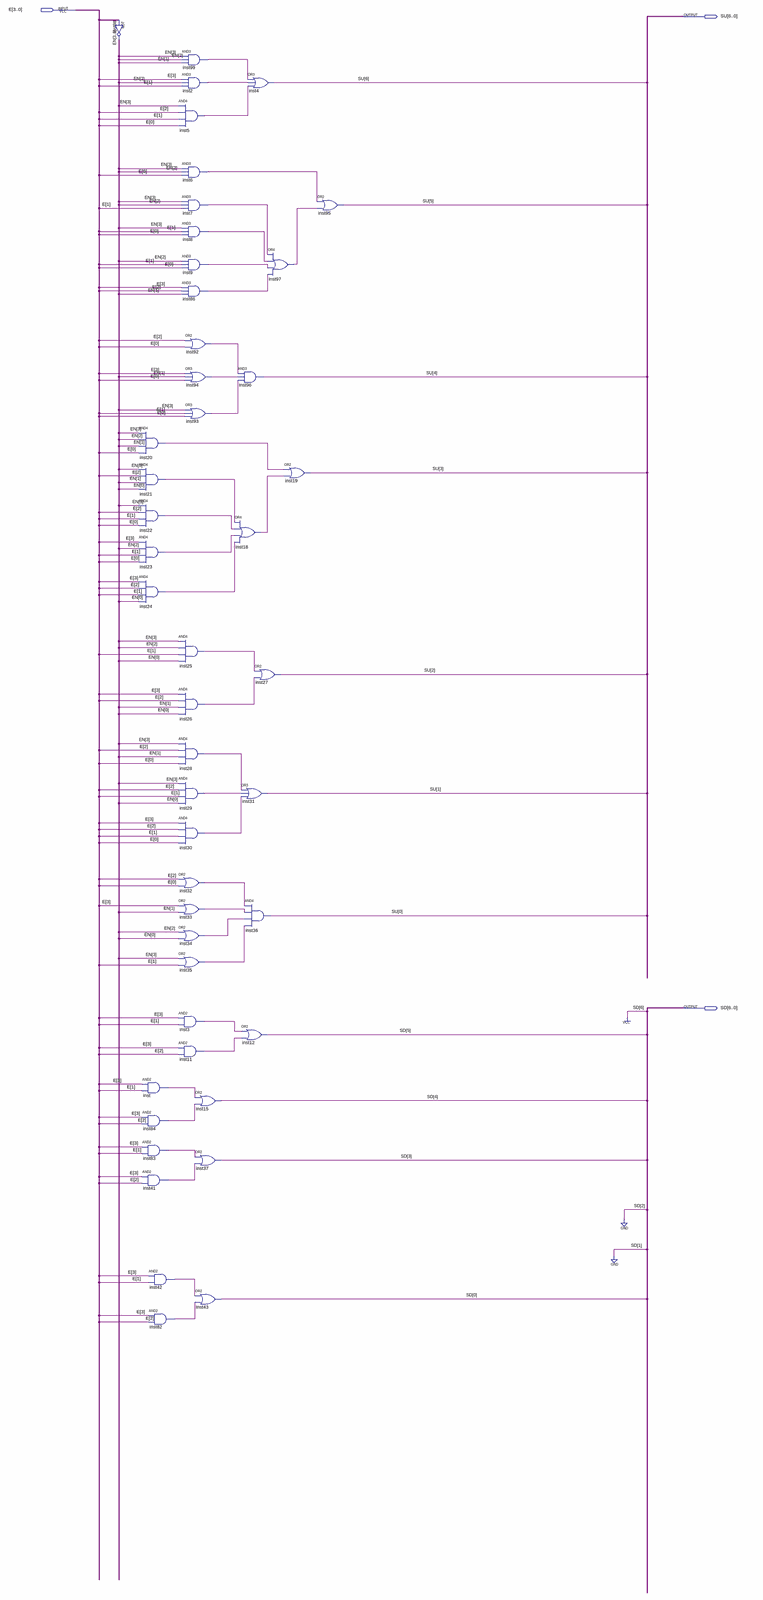
[diagram p0: schematic sheet, whole]
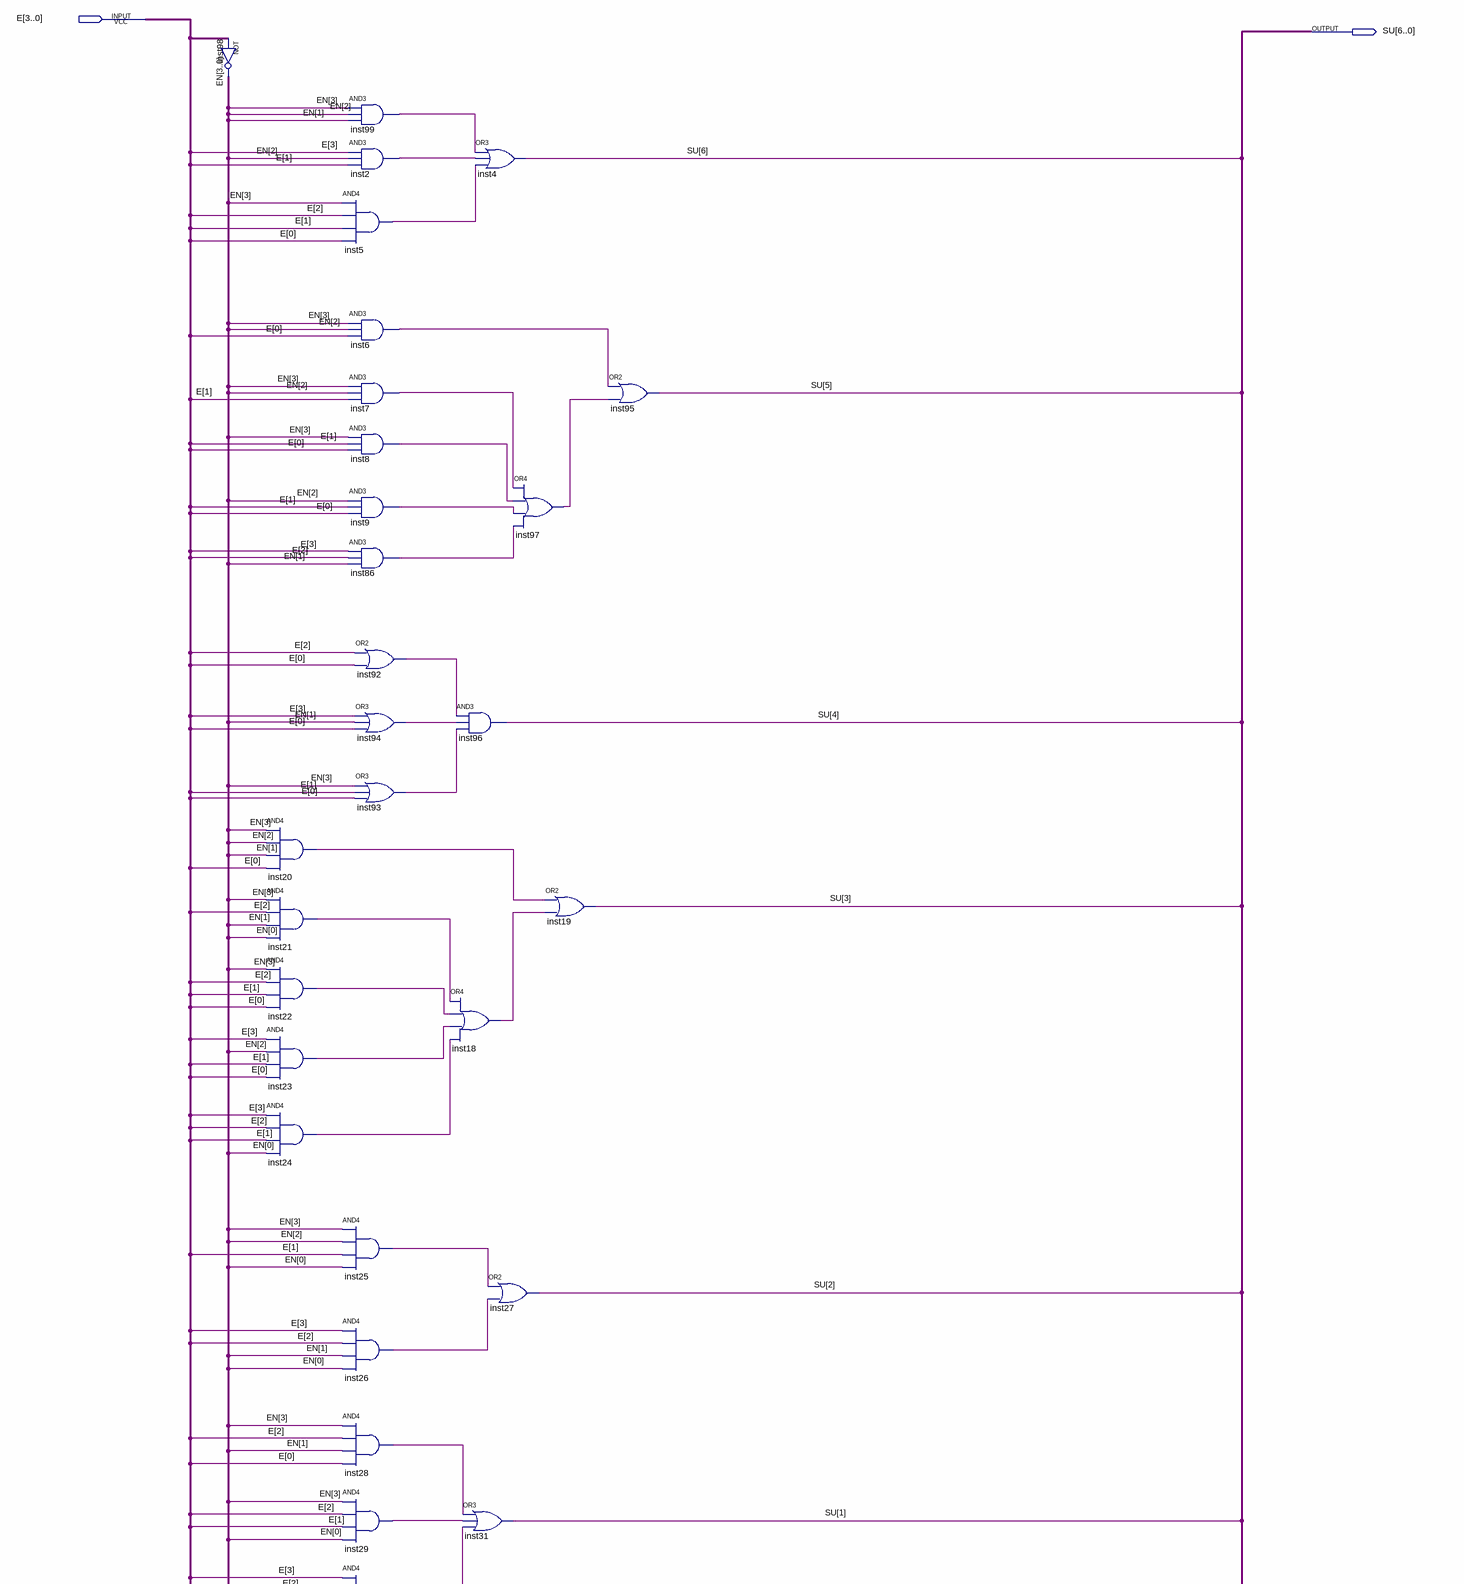
[diagram p1: schematic sheet, upper part]
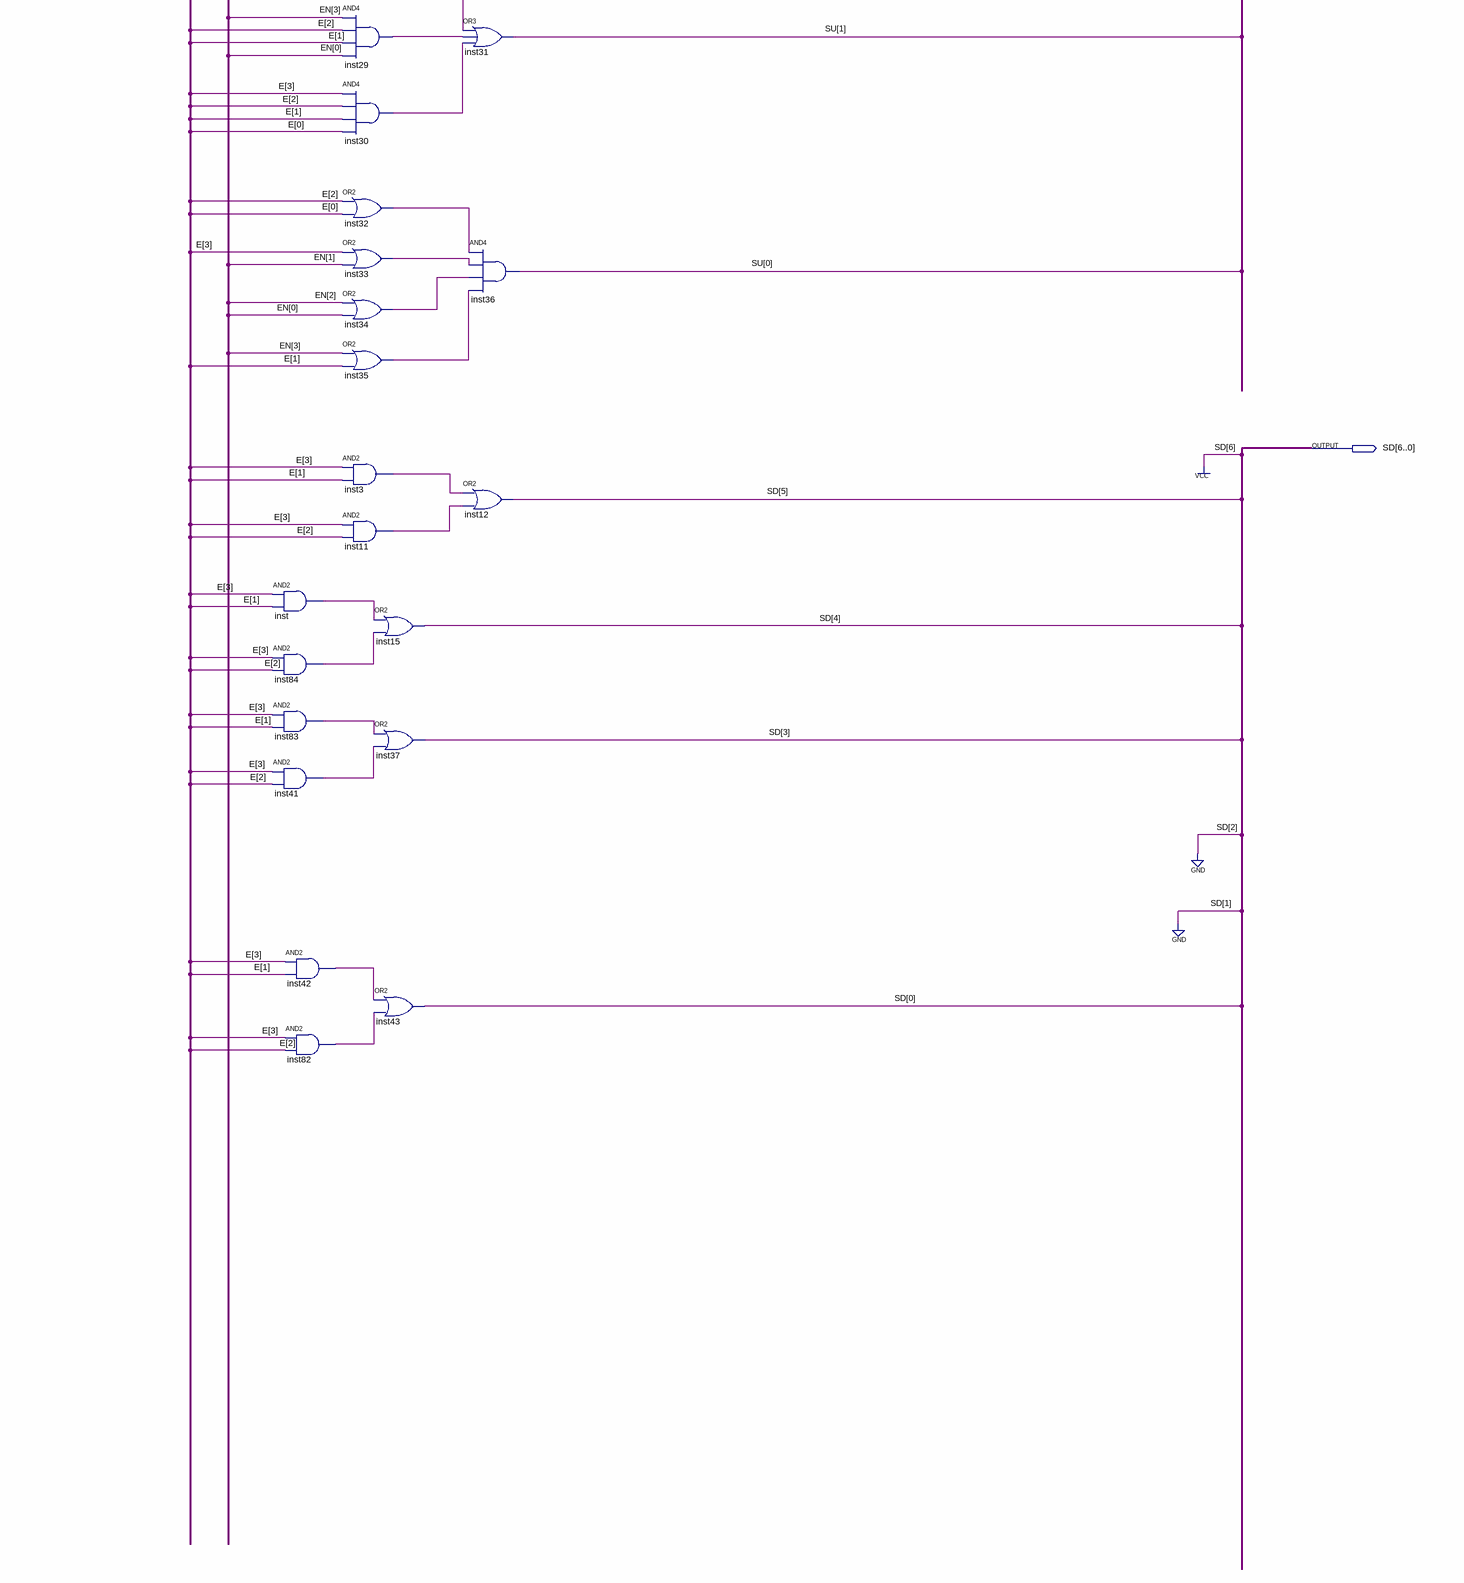
[diagram p2: schematic sheet, lower part]
// Quartus schematic decodificador4bits.bdf as structural Verilog: 47 symbols, 3 pins
module decodificador4bits (
  input  [3:0] E,
  output [6:0] SU,
  output [6:0] SD
);

  wire inst2_out, inst3_out, inst5_out, inst6_out, inst7_out, inst8_out, inst9_out, inst11_out, inst18_out,
       inst20_out, inst21_out, inst22_out, inst23_out, inst24_out, inst25_out, inst26_out, inst28_out,
       inst29_out, inst30_out, inst32_out, inst33_out, inst34_out, inst35_out, inst41_out, inst42_out,
       inst82_out, inst83_out, inst84_out, inst86_out, inst92_out, inst93_out, inst94_out, inst97_out,
       inst99_out, inst_out;
  wire [3:0] EN;

  assign EN = ~E;  // NOT inst98, 4 bits wide
  and inst20 (inst20_out, EN[3], EN[2], EN[1], E[0]);
  and inst21 (inst21_out, EN[3], E[2], EN[1], EN[0]);
  and inst22 (inst22_out, EN[3], E[2], E[1], E[0]);
  and inst23 (inst23_out, E[3], EN[2], E[1], E[0]);
  and inst24 (inst24_out, E[3], E[2], E[1], EN[0]);
  and inst (inst_out, E[3], E[1]);
  and inst84 (inst84_out, E[3], E[2]);
  and inst83 (inst83_out, E[3], E[1]);
  and inst41 (inst41_out, E[3], E[2]);
  and inst42 (inst42_out, E[3], E[1]);
  and inst82 (inst82_out, E[3], E[2]);
  and inst99 (inst99_out, EN[3], EN[2], EN[1]);
  and inst2 (inst2_out, E[3], EN[2], E[1]);
  and inst5 (inst5_out, EN[3], E[2], E[1], E[0]);
  and inst6 (inst6_out, EN[3], EN[2], E[0]);
  and inst7 (inst7_out, EN[3], EN[2], E[1]);
  and inst8 (inst8_out, EN[3], E[1], E[0]);
  and inst9 (inst9_out, EN[2], E[1], E[0]);
  and inst86 (inst86_out, E[3], E[2], EN[1]);
  or inst92 (inst92_out, E[2], E[0]);
  or inst94 (inst94_out, E[3], EN[1], E[0]);
  or inst93 (inst93_out, EN[3], E[1], E[0]);
  and inst25 (inst25_out, EN[3], EN[2], E[1], EN[0]);
  and inst26 (inst26_out, E[3], E[2], EN[1], EN[0]);
  and inst28 (inst28_out, EN[3], E[2], EN[1], E[0]);
  and inst29 (inst29_out, EN[3], E[2], E[1], EN[0]);
  and inst30 (inst30_out, E[3], E[2], E[1], E[0]);
  or inst32 (inst32_out, E[2], E[0]);
  or inst33 (inst33_out, E[3], EN[1]);
  or inst34 (inst34_out, EN[2], EN[0]);
  or inst35 (inst35_out, EN[3], E[1]);
  and inst3 (inst3_out, E[3], E[1]);
  and inst11 (inst11_out, E[3], E[2]);
  or inst15 (SD[4], inst_out, inst84_out);
  or inst37 (SD[3], inst83_out, inst41_out);
  or inst43 (SD[0], inst42_out, inst82_out);
  and inst96 (SU[4], inst92_out, inst94_out, inst93_out);
  or inst18 (inst18_out, inst21_out, inst22_out, inst23_out, inst24_out);
  or inst4 (SU[6], inst99_out, inst2_out, inst5_out);
  or inst27 (SU[2], inst25_out, inst26_out);
  or inst31 (SU[1], inst28_out, inst29_out, inst30_out);
  and inst36 (SU[0], inst32_out, inst33_out, inst34_out, inst35_out);
  or inst12 (SD[5], inst3_out, inst11_out);
  or inst97 (inst97_out, inst7_out, inst8_out, inst9_out, inst86_out);
  or inst19 (SU[3], inst20_out, inst18_out);
  or inst95 (SU[5], inst6_out, inst97_out);

  assign {SD[6], SD[2:1]} = 3'b100;
endmodule
